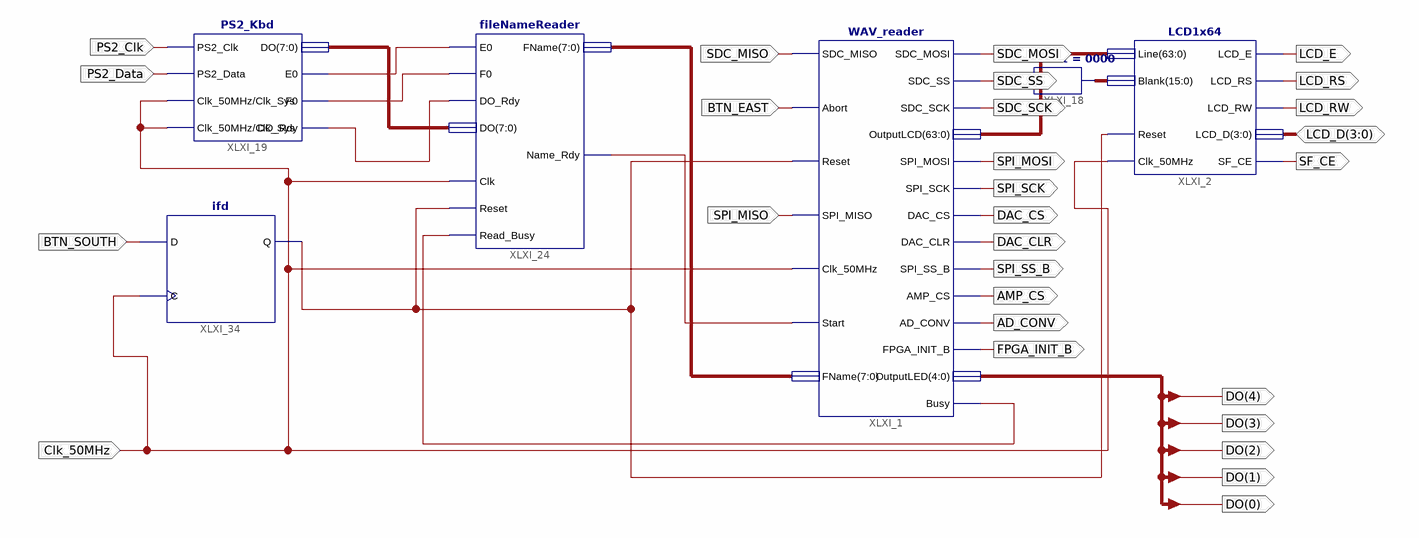
[diagram p0: schematic sheet 1]
// Xilinx ISE schematic endProduct.sch (spartan3e) as structural Verilog: 6 symbols, 28 ports
module endProduct (
  input  Clk_50MHz,
  input  PS2_Clk,
  input  PS2_Data,
  input  BTN_EAST,
  input  SDC_MISO,
  input  SPI_MISO,
  input  BTN_SOUTH,
  inout  [3:0] LCD_D,
  output SDC_MOSI,
  output SDC_SS,
  output SDC_SCK,
  output SPI_MOSI,
  output SPI_SCK,
  output FPGA_INIT_B,
  output AD_CONV,
  output AMP_CS,
  output SPI_SS_B,
  output DAC_CLR,
  output DAC_CS,
  output SF_CE,
  output LCD_RW,
  output LCD_RS,
  output LCD_E,
  output [4:0] DO
);

  wire BTN_WEST, XLXN_5, XLXN_6, XLXN_7, XLXN_50, XLXN_52;
  wire [7:0] XLXN_38, XLXN_48;
  wire [15:0] XLXN_2;
  wire [63:0] XLXN_1;

  WAV_reader XLXI_1 (
    .SDC_MISO(SDC_MISO), .Abort(BTN_EAST), .Reset(XLXN_50), .SPI_MISO(SPI_MISO), .Clk_50MHz(Clk_50MHz),
    .Start(BTN_WEST), .FName(XLXN_38), .SDC_MOSI(SDC_MOSI), .SDC_SS(SDC_SS), .SDC_SCK(SDC_SCK),
    .OutputLCD(XLXN_1), .SPI_MOSI(SPI_MOSI), .SPI_SCK(SPI_SCK), .DAC_CS(DAC_CS), .DAC_CLR(DAC_CLR),
    .SPI_SS_B(SPI_SS_B), .AMP_CS(AMP_CS), .AD_CONV(AD_CONV), .FPGA_INIT_B(FPGA_INIT_B), .Busy(XLXN_52),
    .OutputLED(DO));
  LCD1x64 XLXI_2 (
    .Clk_50MHz(Clk_50MHz), .Reset(XLXN_50), .Line(XLXN_1), .Blank(XLXN_2), .LCD_D(LCD_D), .LCD_E(LCD_E),
    .LCD_RW(LCD_RW), .LCD_RS(LCD_RS), .SF_CE(SF_CE));
  constant #(.CValue("0000")) XLXI_18 (.O(XLXN_2));
  PS2_Kbd XLXI_19 (
    .PS2_Clk(PS2_Clk), .PS2_Data(PS2_Data), .Clk_50MHz(Clk_50MHz), .E0(XLXN_5), .F0(XLXN_6), .DO_Rdy(XLXN_7),
    .DO(XLXN_48), .Clk_Sys(Clk_50MHz));
  ifd XLXI_34 (.C(Clk_50MHz), .D(BTN_SOUTH), .Q(XLXN_50));
  fileNameReader XLXI_24 (
    .E0(XLXN_5), .F0(XLXN_6), .DO_Rdy(XLXN_7), .Reset(XLXN_50), .Clk(Clk_50MHz), .DO(XLXN_48),
    .Name_Rdy(BTN_WEST), .FName(XLXN_38), .Read_Busy(XLXN_52));
endmodule
